# EAGLE board untitled (EAGLE 9.1.3), part 1 of 2
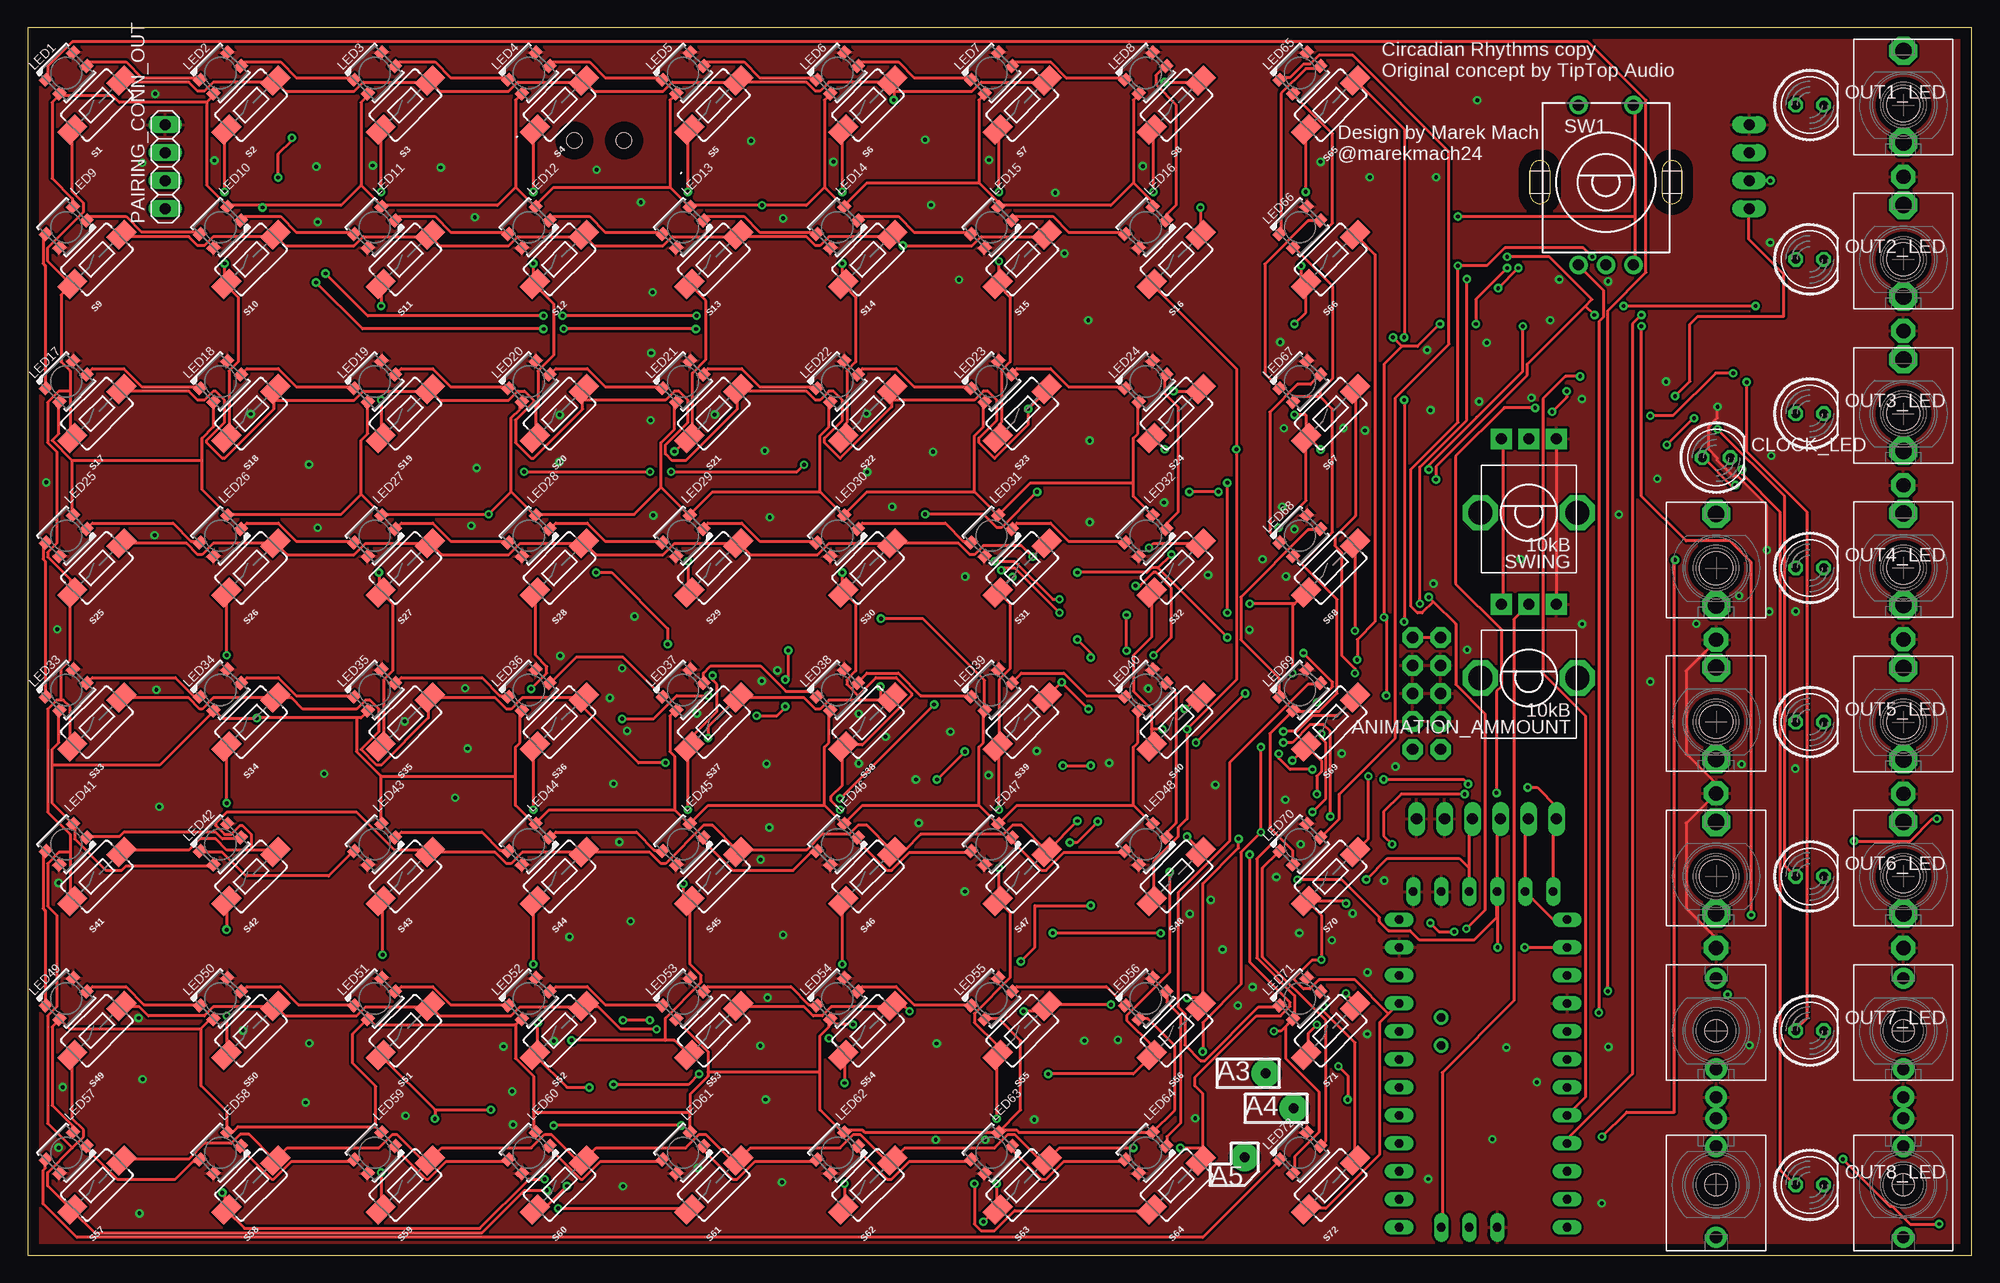
[diagram p6: board, top side]
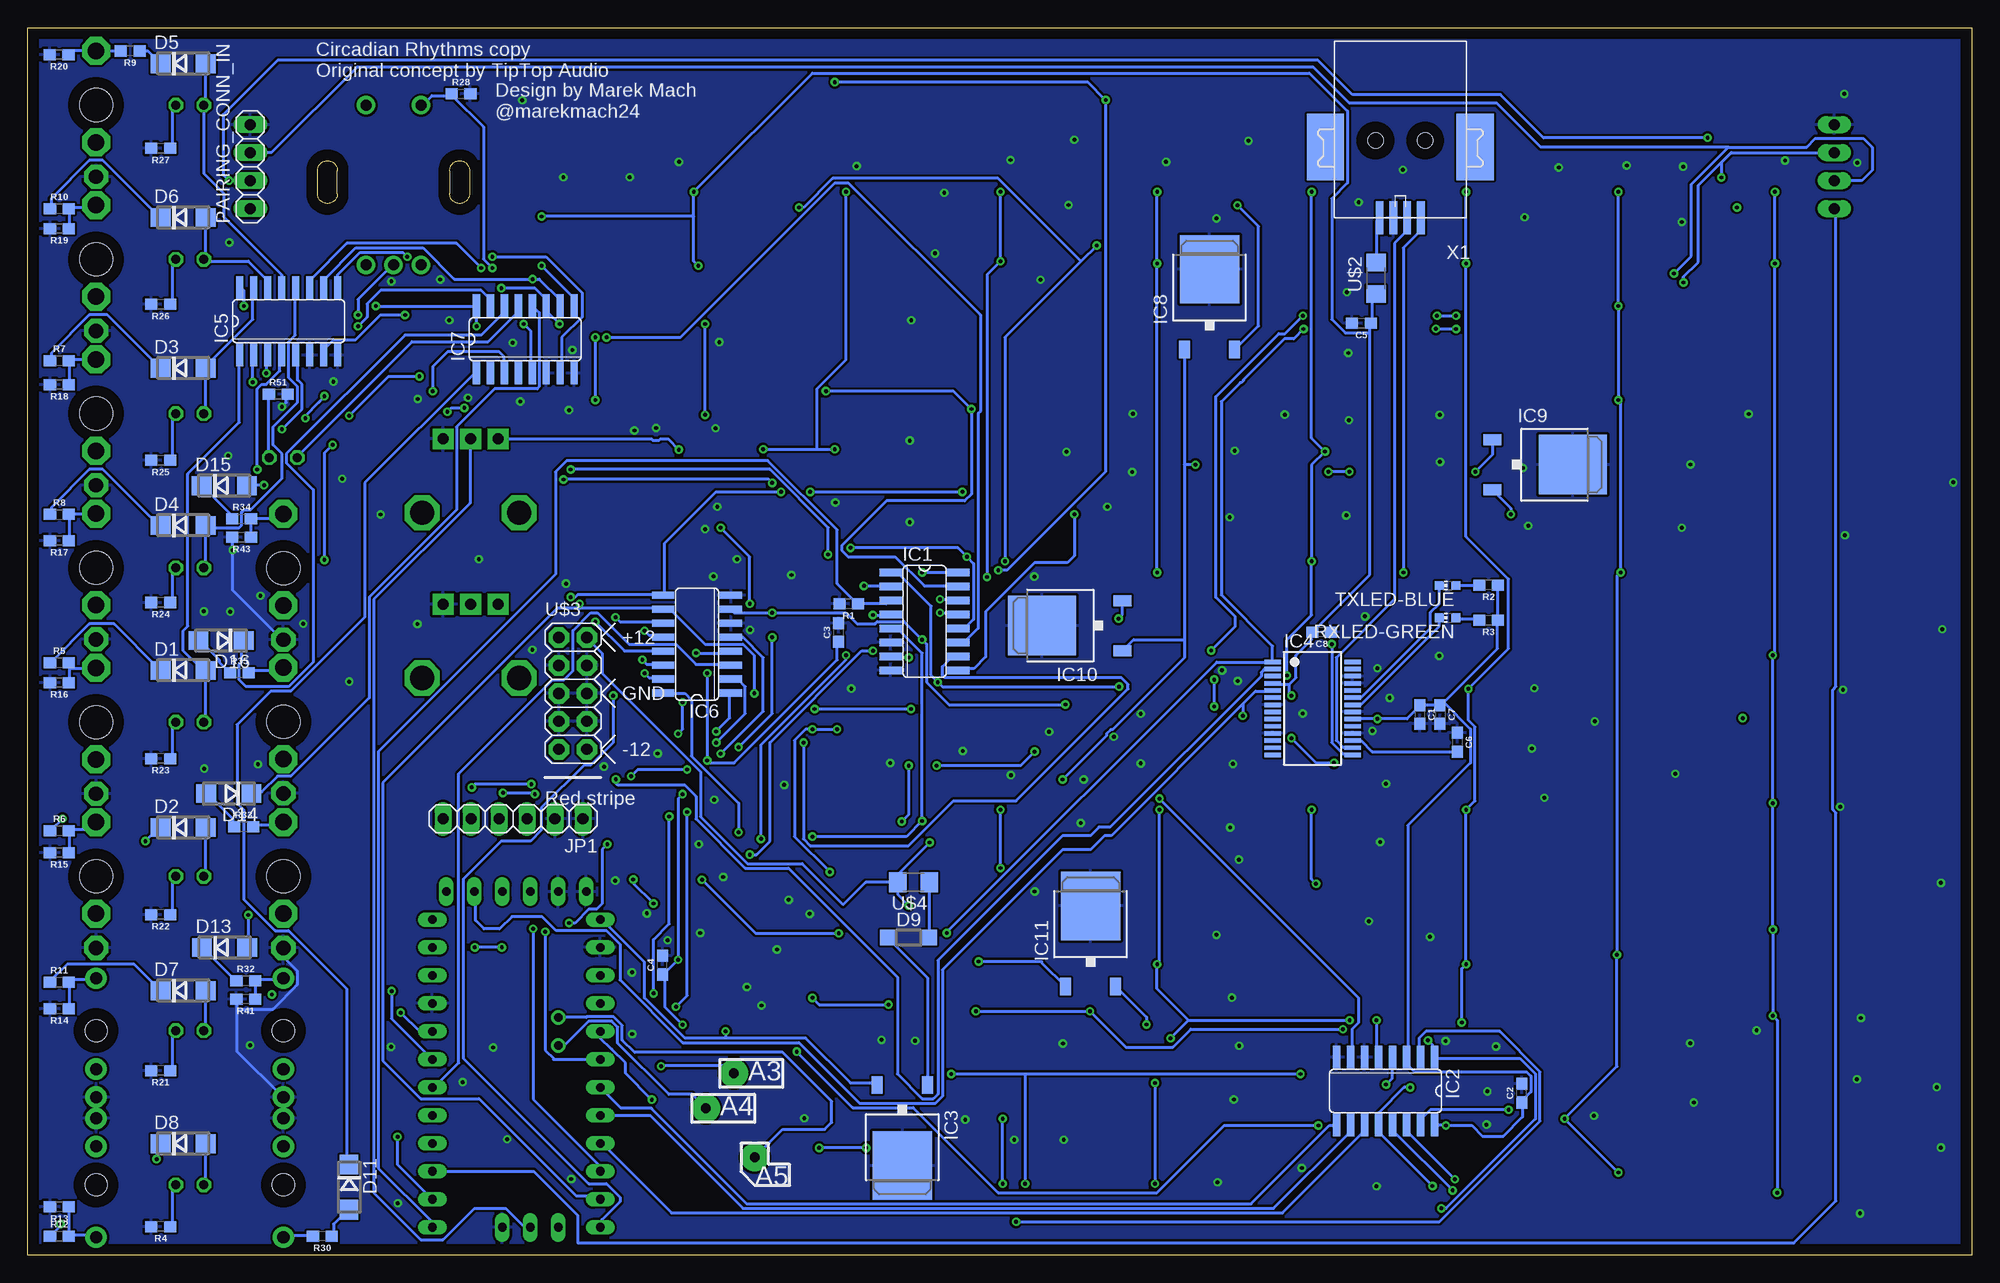
[diagram p7: board, bottom side, seen from below]

Size 176.51 x 111.43 mm. Coordinates in mm from the lower left corner, seen from the top.
Outline: 0,0 176.51,0 176.51,111.43 0,111.43 0,0
Copper layers (1*16): Top 0.035mm / dielectric 1.5mm / Bottom 0.035mm
Design rules "default": minimum track width 6mil, minimum drill 0.35mm, track to track 6mil, track to pad 6mil, pad to pad 6mil, via to via 6mil, smd to smd 6mil, copper to edge 40mil, drill to drill 6mil, minimum pad ring 10mil, minimum via ring 8mil, stop-mask expansion 4mil, vias tented up to drill 0mil, thermal gap 10mil
Net classes: 0 default: width 0.254 mm; 1 5V: width 0.305 mm

## Footprints (pad centres in the part's own frame; a part is rotated, then mirrored left to right if it is on the bottom)
ALPS_POT_VERTICAL = drill 1 pad 1.88 square: P$1 -2.5,6.7; P$2 0,6.7; P$3 2.5,6.7 | drill 2.2 pad 3.175 octagon: P$4 -4.4,0; P$5 4.4,0
WQP_PJ_301M8 = drill 1.1 pad 1.93: P1 0,-6.032; P2 0,-3.493; P3 0,4.763 | hole 2: 0,0
0603 = smd 1.1 x 1: 1 -0.85,0; 2 0.85,0
WQP_PJ_301M1 = drill 1.3 pad 2.184 octagon: P1 0,-6.5 | drill 1.5 pad 2.54 octagon: P2 0,-3.38; P3 0,4.92 | hole 3: 0,0
LED5MM = drill 0.813 octagon: A -1.27,0; K 1.27,0
DO214AC = smd 1.8 x 1.7: A 2.05,0; C -2.05,0
SOD123 = smd 1.4 x 1.4: A 1.9,0; C -1.9,0
SO16 = smd 0.66 x 2.032: 1 -4.445,-3.073; 2 -3.175,-3.073; 3 -1.905,-3.073; 4 -0.635,-3.073; 5 0.635,-3.073; 6 1.905,-3.073; 7 3.175,-3.073; 8 4.445,-3.073; 9 4.445,3.073; 10 3.175,3.073; 11 1.905,3.073; 12 0.635,3.073; 13 -0.635,3.073; 14 -1.905,3.073; 15 -3.175,3.073; 16 -4.445,3.073
TO252 = smd 1 x 1.6: 1 -2.28,-4.8; 2 2.28,-4.8 | smd 5.4 x 6.2: 3 0,2.5
SSOP28 = smd 0.4 x 1.5: 1 -4.225,-3.625; 2 -3.575,-3.625; 3 -2.925,-3.625; 4 -2.275,-3.625; 5 -1.625,-3.625; 6 -0.975,-3.625; 7 -0.325,-3.625; 8 0.325,-3.625; 9 0.975,-3.625; 10 1.625,-3.625; 11 2.275,-3.625; 12 2.925,-3.625; 13 3.575,-3.625; 14 4.225,-3.625; 15 4.225,3.625; 16 3.575,3.625; 17 2.925,3.625; 18 2.275,3.625; 19 1.625,3.625; 20 0.975,3.625; 21 0.325,3.625; 22 -0.325,3.625; 23 -0.975,3.625; 24 -1.625,3.625; 25 -2.275,3.625; 26 -2.925,3.625; 27 -3.575,3.625; 28 -4.225,3.625
1X06 = drill 1.016 long: 1 -6.35,0; 2 -3.81,0; 3 -1.27,0; 4 1.27,0; 5 3.81,0; 6 6.35,0
LED3535 = smd 1 x 0.85: 1 -1.75,0.875; 2 -1.75,-0.875; 3 1.75,-0.875; 4 1.75,0.875
1X04 = drill 1.016 long: 1 -3.81,0; 2 -1.27,0; 3 1.27,0; 4 3.81,0
CHIP-LED0603 = smd 0.8 x 0.8: A 0,-0.75; C 0,0.75
TACTILE_SWITCH_SMD_6.0X3.5MM = smd 2.3 x 1.6: 1 -3.15,0; 2 3.15,0
CI-11 = drill 1 pad 1.676: A -2.5,-7.5; B 0,-7.5; C 2.5,-7.5; D -2.5,7; E 2.5,7
ABK-PRO-MINI = drill 0.8 long: A0 10.16,-11.43; A1 10.16,-8.89; A2 10.16,-6.35; A3 10.16,-3.81; A6 3.81,-21.59; A7 6.35,-21.59; D2 -5.08,-3.81; D3 -5.08,-6.35; D4 -5.08,-8.89; D5 -5.08,-11.43; D6 -5.08,-13.97; D7 -5.08,-16.51; D8 -5.08,-19.05; D9 -5.08,-21.59; D10 10.16,-21.59; D11 10.16,-19.05; D12 10.16,-16.51; D13 10.16,-13.97; DTR -3.81,8.89; GND 10.16,3.81; GND1 -5.08,-1.27; GND2 8.89,8.89; GND3 6.35,8.89; GND4 1.27,-21.59; RAW 10.16,6.35; RST 10.16,1.27; RST1 -5.08,1.27; RX1 -5.08,3.81; RX1-1 1.27,8.89; TX0 -5.08,6.35; TX0-1 -1.27,8.89; VCC 10.16,-1.27; VCC1 3.81,8.89 | drill 0.8: A4 6.35,-5.08; A5 6.35,-2.54
1206 = smd 1.6 x 1.803: 1 -1.422,0; 2 1.422,0
POWER_10 = drill 1.016 pad 1.88 octagon: 1 -5.08,-1.27; 2 -5.08,1.27; 3 -2.54,-1.27; 4 -2.54,1.27; 5 0,-1.27; 6 0,1.27; 7 2.54,-1.27; 8 2.54,1.27; 9 5.08,-1.27; 10 5.08,1.27
USB-B-SMT = smd 6.04 x 3.4: 5 0.58,6.8; 6 0.58,-6.8 | smd 3 x 0.7: D+ 7,1.875; D- 7,0.625; GND 7,-0.625; VUSB 7,-1.875 | hole 1.4: 0,2.25; 0,-2.25

## Placement (x,y rotation side)
ANIMATION_AMMOUNT  10kB  [ALPS_POT_VERTICAL]  136.29,52.4 0 top
ANIMATION_IN  PJ301_THONKICONN8  [WQP_PJ_301M8]  153.28,6.4 180 top
C1  0.1uF  [0603]  50.13,49.09 270 bottom
C2  0.1uF  [0603]  40.87,14.72 90 bottom
C3  0.1uF  [0603]  102.87,56.53 90 bottom
C4  0.1uF  [0603]  118.87,26.34 90 bottom
C5  0.1uF  [0603]  55.42,84.59 180 bottom
C6  0.1uF  [0603]  46.73,46.57 270 bottom
C7  10uF  [0603]  48.29,49.09 270 bottom
C8  0.1uF  [0603]  59.03,56.56 180 bottom
CLOCK_IN  PJ301_THONKICONN1  [WQP_PJ_301M1]  153.28,48.43 0 top
CLOCK_LED  [LED5MM]  153.28,72.4 0 top
CLOCK_OUT  PJ301_THONKICONN1  [WQP_PJ_301M1]  153.28,62.37 0 top
D1  [DO214AC]  162.38,53.09 0 bottom
D2  [DO214AC]  162.38,38.82 0 bottom
D3  [DO214AC]  162.38,80.51 0 bottom
D4  [DO214AC]  162.38,66.24 0 bottom
D5  [DO214AC]  162.38,108.15 0 bottom
D6  [DO214AC]  162.38,94.18 0 bottom
D7  [DO214AC]  162.38,24.02 0 bottom
D8  [DO214AC]  162.38,10.13 0 bottom
D9  1N5819HW  [SOD123]  96.55,28.83 0 bottom
D11  [DO214AC]  147.33,6.19 270 bottom
D13  [DO214AC]  158.62,27.93 0 bottom
D14  [DO214AC]  158.23,41.92 180 bottom
D15  [DO214AC]  158.65,69.84 0 bottom
D16  [DO214AC]  158.94,55.81 180 bottom
IC1  4051D  [SO16]  95.08,57.53 270 bottom
IC2  4051D  [SO16]  53.23,14.92 180 bottom
IC3  7805DT  [TO252]  97.1,10.65 180 bottom
IC4  FT232RL  [SSOP28]  59.86,49.64 270 bottom
IC5  4051D  [SO16]  152.81,84.78 0 bottom
IC6  4051D  [SO16]  115.74,55.47 90 bottom
IC7  4051D  [SO16]  131.33,83.14 0 bottom
IC8  7805DT  [TO252]  69.22,87 0 bottom
IC9  7805DT  [TO252]  38.73,71.75 270 bottom
IC10  7805DT  [TO252]  81.92,57.15 90 bottom
IC11  7805DT  [TO252]  80.01,29.21 0 bottom
JP1  [1X06]  132.44,39.61 180 bottom
LED1  WS2812B3535  [LED3535]  3.51,107.31 45 top
LED2  WS2812B3535  [LED3535]  17.51,107.31 45 top
LED3  WS2812B3535  [LED3535]  31.51,107.31 45 top
LED4  WS2812B3535  [LED3535]  45.51,107.31 45 top
LED5  WS2812B3535  [LED3535]  59.51,107.31 45 top
LED6  WS2812B3535  [LED3535]  73.51,107.31 45 top
LED7  WS2812B3535  [LED3535]  87.51,107.31 45 top
LED8  WS2812B3535  [LED3535]  101.51,107.31 45 top
LED9  WS2812B3535  [LED3535]  3.51,93.31 225 top
LED10  WS2812B3535  [LED3535]  17.51,93.31 225 top
LED11  WS2812B3535  [LED3535]  31.51,93.31 225 top
LED12  WS2812B3535  [LED3535]  45.51,93.31 225 top
LED13  WS2812B3535  [LED3535]  59.51,93.31 225 top
LED14  WS2812B3535  [LED3535]  73.51,93.31 225 top
LED15  WS2812B3535  [LED3535]  87.51,93.31 225 top
LED16  WS2812B3535  [LED3535]  101.51,93.31 225 top
LED17  WS2812B3535  [LED3535]  3.51,79.31 45 top
LED18  WS2812B3535  [LED3535]  17.51,79.31 45 top
LED19  WS2812B3535  [LED3535]  31.51,79.31 45 top
LED20  WS2812B3535  [LED3535]  45.51,79.31 45 top
LED21  WS2812B3535  [LED3535]  59.51,79.31 45 top
LED22  WS2812B3535  [LED3535]  73.51,79.31 45 top
LED23  WS2812B3535  [LED3535]  87.51,79.31 45 top
LED24  WS2812B3535  [LED3535]  101.51,79.31 45 top
LED25  WS2812B3535  [LED3535]  3.51,65.31 225 top
LED26  WS2812B3535  [LED3535]  17.51,65.31 225 top
LED27  WS2812B3535  [LED3535]  31.51,65.31 225 top
LED28  WS2812B3535  [LED3535]  45.51,65.31 225 top
LED29  WS2812B3535  [LED3535]  59.51,65.31 225 top
LED30  WS2812B3535  [LED3535]  73.51,65.31 225 top
LED31  WS2812B3535  [LED3535]  87.51,65.31 225 top
LED32  WS2812B3535  [LED3535]  101.51,65.31 225 top
LED33  WS2812B3535  [LED3535]  3.51,51.31 45 top
LED34  WS2812B3535  [LED3535]  17.51,51.31 45 top
LED35  WS2812B3535  [LED3535]  31.51,51.31 45 top
LED36  WS2812B3535  [LED3535]  45.51,51.31 45 top
LED37  WS2812B3535  [LED3535]  59.51,51.31 45 top
LED38  WS2812B3535  [LED3535]  73.51,51.31 45 top
LED39  WS2812B3535  [LED3535]  87.51,51.31 45 top
LED40  WS2812B3535  [LED3535]  101.51,51.31 45 top
LED41  WS2812B3535  [LED3535]  3.51,37.31 225 top
LED42  WS2812B3535  [LED3535]  17.51,37.31 45 top
LED43  WS2812B3535  [LED3535]  31.51,37.31 225 top
LED44  WS2812B3535  [LED3535]  45.51,37.31 225 top
LED45  WS2812B3535  [LED3535]  59.51,37.31 225 top
LED46  WS2812B3535  [LED3535]  73.51,37.31 225 top
LED47  WS2812B3535  [LED3535]  87.51,37.31 225 top
LED48  WS2812B3535  [LED3535]  101.51,37.31 225 top
LED49  WS2812B3535  [LED3535]  3.51,23.31 45 top
LED50  WS2812B3535  [LED3535]  17.51,23.31 45 top
LED51  WS2812B3535  [LED3535]  31.51,23.31 45 top
LED52  WS2812B3535  [LED3535]  45.51,23.31 45 top
LED53  WS2812B3535  [LED3535]  59.51,23.31 45 top
LED54  WS2812B3535  [LED3535]  73.51,23.31 45 top
LED55  WS2812B3535  [LED3535]  87.51,23.31 45 top
LED56  WS2812B3535  [LED3535]  101.51,23.31 45 top
LED57  WS2812B3535  [LED3535]  3.51,9.31 225 top
LED58  WS2812B3535  [LED3535]  17.51,9.31 225 top
LED59  WS2812B3535  [LED3535]  31.51,9.31 225 top
LED60  WS2812B3535  [LED3535]  45.51,9.31 225 top
LED61  WS2812B3535  [LED3535]  59.51,9.31 225 top
LED62  WS2812B3535  [LED3535]  73.51,9.31 225 top
LED63  WS2812B3535  [LED3535]  87.51,9.31 225 top
LED64  WS2812B3535  [LED3535]  101.51,9.31 225 top
LED65  WS2812B3535  [LED3535]  115.51,107.31 45 top
LED66  WS2812B3535  [LED3535]  115.51,93.31 45 top
LED67  WS2812B3535  [LED3535]  115.51,79.31 45 top
LED68  WS2812B3535  [LED3535]  115.51,65.31 45 top
LED69  WS2812B3535  [LED3535]  115.51,51.31 45 top
LED70  WS2812B3535  [LED3535]  115.51,37.31 45 top
LED71  WS2812B3535  [LED3535]  115.51,23.31 45 top
LED72  WS2812B3535  [LED3535]  115.51,9.31 45 top
OUT1  PJ301_THONKICONN1  [WQP_PJ_301M1]  170.29,104.4 0 top
OUT1_LED  [LED5MM]  161.79,104.4 0 top
OUT2  PJ301_THONKICONN1  [WQP_PJ_301M1]  170.29,90.4 0 top
OUT2_LED  [LED5MM]  161.79,90.4 0 top
OUT3  PJ301_THONKICONN1  [WQP_PJ_301M1]  170.29,76.4 0 top
OUT3_LED  [LED5MM]  161.79,76.4 0 top
OUT4  PJ301_THONKICONN1  [WQP_PJ_301M1]  170.29,62.4 0 top
OUT4_LED  [LED5MM]  161.79,62.4 0 top
OUT5  PJ301_THONKICONN1  [WQP_PJ_301M1]  170.29,48.4 0 top
OUT5_LED  [LED5MM]  161.79,48.4 0 top
OUT6  PJ301_THONKICONN1  [WQP_PJ_301M1]  170.29,34.4 0 top
OUT6_LED  [LED5MM]  161.79,34.4 0 top
OUT7  PJ301_THONKICONN8  [WQP_PJ_301M8]  170.29,20.4 0 top
OUT7_LED  [LED5MM]  161.79,20.4 0 top
OUT8  PJ301_THONKICONN8  [WQP_PJ_301M8]  170.29,6.4 180 top
OUT8_LED  [LED5MM]  161.79,6.4 0 top
PAIRING_CONN_IN  [1X04]  156.29,98.81 90 bottom
PAIRING_CONN_OUT  [1X04]  12.5,98.81 90 top
R1  10k  [0603]  101.96,59.13 180 bottom
R2  470  [0603]  43.87,60.83 180 bottom
R3  470  [0603]  43.87,57.64 180 bottom
R4  470  [0603]  164.42,2.61 180 bottom
R5  100  [0603]  173.62,53.79 0 bottom
R6  100  [0603]  173.62,38.55 0 bottom
R7  100  [0603]  173.62,81.21 0 bottom
R8  100  [0603]  173.62,67.24 0 bottom
R9  100  [0603]  167.19,109.3 180 bottom
R10  100  [0603]  173.62,94.99 0 bottom
R11  100  [0603]  173.62,24.8 0 bottom
R12  100  [0603]  173.62,1.75 0 bottom
R13  10k  [0603]  173.62,4.41 180 bottom
R14  10k  [0603]  173.62,22.38 180 bottom
R15  10k  [0603]  173.62,36.54 180 bottom
R16  10k  [0603]  173.62,51.97 180 bottom
R17  10k  [0603]  173.62,64.86 180 bottom
R18  10k  [0603]  173.62,79.02 180 bottom
R19  10k  [0603]  173.62,93.18 180 bottom
R20  10k  [0603]  173.65,108.97 180 bottom
R21  470  [0603]  164.42,16.77 180 bottom
R22  470  [0603]  164.42,30.93 180 bottom
R23  470  [0603]  164.42,45.09 180 bottom
R24  470  [0603]  164.42,59.25 180 bottom
R25  470  [0603]  164.42,72.14 180 bottom
R26  470  [0603]  164.42,86.3 180 bottom
R27  470  [0603]  164.42,100.46 180 bottom
R28  10k  [0603]  137.16,105.41 0 bottom
R30  100  [0603]  149.75,1.74 180 bottom
R32  100  [0603]  156.7,24.93 0 bottom
R33  100  [0603]  156.89,38.9 0 bottom
R34  100  [0603]  157.08,66.84 0 bottom
R35  100  [0603]  157.27,52.87 0 bottom
R41  10k  [0603]  156.7,23.25 180 bottom
R43  10k  [0603]  157.08,65.16 180 bottom
R51  470  [0603]  153.75,78.16 0 bottom
RESET_IN  PJ301_THONKICONN1  [WQP_PJ_301M1]  153.28,34.4 0 top
RESET_OUT  PJ301_THONKICONN8  [WQP_PJ_301M8]  153.28,20.4 0 top
RXLED-GREEN  [CHIP-LED0603]  47.6,57.87 90 bottom
S1  [TACTILE_SWITCH_SMD_6.0X3.5MM]  6.29,104.4 45 top
S2  [TACTILE_SWITCH_SMD_6.0X3.5MM]  20.29,104.4 45 top
S3  [TACTILE_SWITCH_SMD_6.0X3.5MM]  34.29,104.4 45 top
S4  [TACTILE_SWITCH_SMD_6.0X3.5MM]  48.29,104.4 45 top
S5  [TACTILE_SWITCH_SMD_6.0X3.5MM]  62.29,104.4 45 top
S6  [TACTILE_SWITCH_SMD_6.0X3.5MM]  76.29,104.4 45 top
S7  [TACTILE_SWITCH_SMD_6.0X3.5MM]  90.29,104.4 45 top
S8  [TACTILE_SWITCH_SMD_6.0X3.5MM]  104.29,104.4 45 top
S9  [TACTILE_SWITCH_SMD_6.0X3.5MM]  6.29,90.4 45 top
S10  [TACTILE_SWITCH_SMD_6.0X3.5MM]  20.29,90.4 45 top
S11  [TACTILE_SWITCH_SMD_6.0X3.5MM]  34.29,90.4 45 top
S12  [TACTILE_SWITCH_SMD_6.0X3.5MM]  48.29,90.4 45 top
S13  [TACTILE_SWITCH_SMD_6.0X3.5MM]  62.29,90.4 45 top
S14  [TACTILE_SWITCH_SMD_6.0X3.5MM]  76.29,90.4 45 top
S15  [TACTILE_SWITCH_SMD_6.0X3.5MM]  90.29,90.4 45 top
S16  [TACTILE_SWITCH_SMD_6.0X3.5MM]  104.29,90.4 45 top
S17  [TACTILE_SWITCH_SMD_6.0X3.5MM]  6.29,76.4 45 top
S18  [TACTILE_SWITCH_SMD_6.0X3.5MM]  20.29,76.4 45 top
S19  [TACTILE_SWITCH_SMD_6.0X3.5MM]  34.29,76.4 45 top
S20  [TACTILE_SWITCH_SMD_6.0X3.5MM]  48.29,76.4 45 top
S21  [TACTILE_SWITCH_SMD_6.0X3.5MM]  62.29,76.4 45 top
S22  [TACTILE_SWITCH_SMD_6.0X3.5MM]  76.29,76.4 45 top
S23  [TACTILE_SWITCH_SMD_6.0X3.5MM]  90.29,76.4 45 top
S24  [TACTILE_SWITCH_SMD_6.0X3.5MM]  104.29,76.4 45 top
S25  [TACTILE_SWITCH_SMD_6.0X3.5MM]  6.29,62.4 45 top
S26  [TACTILE_SWITCH_SMD_6.0X3.5MM]  20.29,62.4 45 top
S27  [TACTILE_SWITCH_SMD_6.0X3.5MM]  34.29,62.4 45 top
S28  [TACTILE_SWITCH_SMD_6.0X3.5MM]  48.29,62.4 45 top
S29  [TACTILE_SWITCH_SMD_6.0X3.5MM]  62.29,62.4 45 top
S30  [TACTILE_SWITCH_SMD_6.0X3.5MM]  76.29,62.4 45 top
S31  [TACTILE_SWITCH_SMD_6.0X3.5MM]  90.29,62.4 45 top
S32  [TACTILE_SWITCH_SMD_6.0X3.5MM]  104.29,62.4 45 top
S33  [TACTILE_SWITCH_SMD_6.0X3.5MM]  6.29,48.4 45 top
S34  [TACTILE_SWITCH_SMD_6.0X3.5MM]  20.29,48.4 45 top
S35  [TACTILE_SWITCH_SMD_6.0X3.5MM]  34.29,48.4 45 top
S36  [TACTILE_SWITCH_SMD_6.0X3.5MM]  48.29,48.4 45 top
S37  [TACTILE_SWITCH_SMD_6.0X3.5MM]  62.29,48.4 45 top
S38  [TACTILE_SWITCH_SMD_6.0X3.5MM]  76.29,48.4 45 top
S39  [TACTILE_SWITCH_SMD_6.0X3.5MM]  90.29,48.4 45 top
S40  [TACTILE_SWITCH_SMD_6.0X3.5MM]  104.29,48.4 45 top
S41  [TACTILE_SWITCH_SMD_6.0X3.5MM]  6.29,34.4 45 top
S42  [TACTILE_SWITCH_SMD_6.0X3.5MM]  20.29,34.4 45 top
S43  [TACTILE_SWITCH_SMD_6.0X3.5MM]  34.29,34.4 45 top
S44  [TACTILE_SWITCH_SMD_6.0X3.5MM]  48.29,34.4 45 top
S45  [TACTILE_SWITCH_SMD_6.0X3.5MM]  62.29,34.4 45 top
S46  [TACTILE_SWITCH_SMD_6.0X3.5MM]  76.29,34.4 45 top
S47  [TACTILE_SWITCH_SMD_6.0X3.5MM]  90.29,34.4 45 top
S48  [TACTILE_SWITCH_SMD_6.0X3.5MM]  104.29,34.4 45 top
S49  [TACTILE_SWITCH_SMD_6.0X3.5MM]  6.29,20.4 45 top
S50  [TACTILE_SWITCH_SMD_6.0X3.5MM]  20.29,20.4 45 top
S51  [TACTILE_SWITCH_SMD_6.0X3.5MM]  34.29,20.4 45 top
S52  [TACTILE_SWITCH_SMD_6.0X3.5MM]  48.29,20.4 45 top
S53  [TACTILE_SWITCH_SMD_6.0X3.5MM]  62.29,20.4 45 top
S54  [TACTILE_SWITCH_SMD_6.0X3.5MM]  76.29,20.4 45 top
S55  [TACTILE_SWITCH_SMD_6.0X3.5MM]  90.29,20.4 45 top
S56  [TACTILE_SWITCH_SMD_6.0X3.5MM]  104.29,20.4 45 top
S57  [TACTILE_SWITCH_SMD_6.0X3.5MM]  6.29,6.4 45 top
S58  [TACTILE_SWITCH_SMD_6.0X3.5MM]  20.29,6.4 45 top
S59  [TACTILE_SWITCH_SMD_6.0X3.5MM]  34.29,6.4 45 top
S60  [TACTILE_SWITCH_SMD_6.0X3.5MM]  48.29,6.4 45 top
S61  [TACTILE_SWITCH_SMD_6.0X3.5MM]  62.29,6.4 45 top
S62  [TACTILE_SWITCH_SMD_6.0X3.5MM]  76.29,6.4 45 top
S63  [TACTILE_SWITCH_SMD_6.0X3.5MM]  90.29,6.4 45 top
S64  [TACTILE_SWITCH_SMD_6.0X3.5MM]  104.29,6.4 45 top
S65  [TACTILE_SWITCH_SMD_6.0X3.5MM]  118.29,104.4 45 top
S66  [TACTILE_SWITCH_SMD_6.0X3.5MM]  118.29,90.4 45 top
S67  [TACTILE_SWITCH_SMD_6.0X3.5MM]  118.29,76.4 45 top
S68  [TACTILE_SWITCH_SMD_6.0X3.5MM]  118.29,62.4 45 top
S69  [TACTILE_SWITCH_SMD_6.0X3.5MM]  118.29,48.4 45 top
S70  [TACTILE_SWITCH_SMD_6.0X3.5MM]  118.29,34.4 45 top
S71  [TACTILE_SWITCH_SMD_6.0X3.5MM]  118.29,20.4 45 top
S72  [TACTILE_SWITCH_SMD_6.0X3.5MM]  118.29,6.4 45 top
SW1  CI-11  [CI-11]  143.29,97.4 0 top
SWING  10kB  [ALPS_POT_VERTICAL]  136.29,67.4 0 top
TXLED-BLUE  [CHIP-LED0603]  47.6,60.79 90 bottom
U$1  ABK-PRO-MINI  [ABK-PRO-MINI]  134.68,24.13 0 bottom
U$2  PTC-FUSE  [1206]  54.09,88.68 90 bottom
U$3  POWER_SIMPLE10  [POWER_10]  127,51 90 bottom
U$4  PTC-FUSE  [1206]  96.09,33.86 180 bottom
X1  [USB-B-SMT]  51.89,101.18 270 bottom

## Tracks (layer width: path | path; a pad name or v marks a point on that pad's centre or on a via)
5V_FROM_SOURCE1  (via drill 0.35)
  Top 0.254: 117.35,77.93 114.91,77.93 LED67.2 | 115.62,90.83 115.01,91.44 LED66.2 | 115.62,90.83 118.47,87.99 118.47,79.58 117.35,78.46 117.35,77.93 | 115.62,90.83 118.47,93.67 118.47,101.8 115.01,105.26 LED65.2 | LED72.2 115.01,7.52 115.01,8.94 117.25,11.18 117.25,14.83 114.2,17.88 114.2,20.73 114.81,21.34 LED71.2 | 113.59,38 112.78,38.81 112.78,47.35 114.81,49.38 LED69.2 115.01,49.38 117.25,49.38 118.87,51 118.87,59.54 115.62,62.79 | 113.59,38 114.81,36.78 114.81,35.56 LED70.2 | 115.62,62.79 115.01,63.4 LED68.2 | 113.59,38 111.58,35.99 111.58,27 115.01,23.57 115.01,21.54 LED71.2 | 117.35,77.93 118.47,76.81 118.47,65.63 115.62,62.79 | LED71.2 113.77,20.34 v113.14,20.34
  Bottom 0.254: IC3.2 99.57,15.65 101.8,15.65 105.87,19.71 113.16,19.71 | 113.16,19.71 116.84,19.71 120.5,23.37 120.5,26.62 124.36,30.48 U$1.RAW | v113.14,20.34 113.14,19.73 113.16,19.71
5V_LED_SOURCE1  (via drill 0.35)
  Top 0.254: 86.36,97.33 87.99,95.71 87.99,95.3 LED15.2 88.19,95.3 98.35,95.3 100.38,97.33 | 86.36,97.33 86.36,104.85 86.77,105.26 LED7.2 | 100.38,97.33 102.01,95.71 102.01,95.3 LED16.2 | 100.38,97.33 100.38,104.85 100.79,105.26 LED8.2 | 58.32,96.93 59.94,95.3 LED13.2 60.15,95.3 v66.67,95.3 70.71,95.3 72.34,96.93 | 58.32,96.93 58.32,104.85 58.73,105.26 LED5.2 | 72.34,96.93 73.97,95.3 LED14.2 74.17,95.3 76.2,97.33 86.36,97.33 | 72.34,96.93 72.34,104.85 72.75,105.26 LED6.2 | LED9.2 4.06,95.3 4.06,95.91 2.23,97.74 2.23,104.65 2.85,105.26 LED1.2 3.05,105.26 7.72,105.26 8.33,104.65 16.26,104.65 | 16.26,104.65 16.26,97.13 18.09,95.3 LED10.2 18.29,95.3 21.34,95.3 | 16.26,104.65 16.87,105.26 LED2.2 | 30.28,97.13 32.11,95.3 LED11.2 32.31,95.3 42.67,95.3 44.3,96.93 | 30.28,97.13 30.28,104.65 30.89,105.26 LED3.2 | 44.3,96.93 45.92,95.3 LED12.2 46.13,95.3 47.75,96.93 58.32,96.93 | 44.3,96.93 44.3,104.85 44.7,105.26 LED4.2 | 21.34,95.3 28.45,95.3 30.28,97.13 | v21.34,95.1 21.34,95.3
  Bottom 0.254: IC8.2 64.77,84.36 64.77,93.4 v66.67,95.3
5V_LED_SOURCE2  (via drill 0.35)
  Top 0.254: 4.06,72.14 2.23,73.97 2.85,74.57 2.85,77.42 LED17.2 | 4.06,72.14 4.06,67.26 LED25.2 | 15.85,72.14 15.85,69.49 18.09,67.26 18.09,67.21 LED26.2 18.22,67.26 28.45,67.26 30.28,69.09 | 15.85,72.14 15.85,74.17 16.87,75.18 16.87,77.42 16.89,77.44 LED18.2 | 15.85,72.14 4.06,72.14 | 30.28,69.09 30.28,73.97 30.89,74.57 30.89,77.42 LED19.2 | 30.28,69.09 32.11,67.26 LED27.2 32.22,67.17 32.31,67.26 v41.86,67.26 43.89,69.29 | 43.89,69.29 43.89,76 44.7,76.81 44.7,77.42 LED20.2 | 43.89,69.29 45.92,67.26 LED28.2 46.13,67.26 | 57.51,69.7 57.51,73.76 58.73,74.98 58.73,77.42 LED21.2 | 57.51,69.7 59.94,67.26 LED29.2 60.13,67.24 62.18,69.29 71.93,69.29 | 46.13,67.26 55.07,67.26 57.51,69.7 | 71.93,69.29 71.93,74.37 72.75,75.18 72.75,77.42 LED22.2 | 71.93,69.29 73.97,67.26 LED30.2 74.13,67.22 76.2,69.29 85.95,69.29 | 85.95,69.29 85.95,74.37 86.77,75.18 86.77,77.42 LED23.2 | 85.95,69.29 87.99,67.26 LED31.2 88.13,67.2 91.03,70.1 100.38,70.1 | 100.38,70.1 100.38,68.89 102.01,67.26 LED32.2 | 100.38,70.1 100.38,74.17 100.79,74.57 100.79,77.42 LED24.2 | 46.13,67.26
  Bottom 0.254: IC9.2 41.86,67.8 v41.86,67.26
5V_LED_SOURCE3  (via drill 0.35)
  Top 0.254: 2.23,44.5 2.23,41.05 4.06,39.22 LED41.2 4.27,39.01 4.27,37.8 7.11,34.95 8.53,34.95 8.94,35.36 16.79,35.36 | 2.23,44.5 2.23,45.92 2.85,46.53 2.85,49.38 LED33.2 | 16.79,35.36 16.87,35.36 | 2.23,44.5 11.99,44.5 16.89,49.4 LED34.2 16.99,49.46 17.69,48.76 v20.81,48.76 20.82,48.77 29.87,48.77 | 44.3,43.48 44.3,40.84 45.92,39.22 LED44.2 46.13,39.22 47.35,40.44 58.73,40.44 | 44.3,43.48 44.3,46.13 44.7,46.53 44.7,49.38 LED36.2 | 29.87,48.77 30.28,48.77 30.89,49.38 LED35.2 | 32.11,43.48 32.11,39.22 32.13,39.2 LED43.2 | 32.11,43.48 29.87,45.72 29.87,48.77 | 32.11,43.48 44.3,43.48 | 58.73,40.44 59.94,39.22 LED45.2 60.13,39.2 61.77,40.84 72.34,40.84 | 58.73,40.44 58.73,45.31 58.32,45.72 58.32,48.97 58.73,49.38 LED37.2 | 72.34,40.84 72.34,46.13 72.75,46.53 72.75,49.38 LED38.2 | 72.34,40.84 73.97,39.22 LED46.2 75.79,40.84 86.36,40.84 | 86.36,40.84 86.36,46.13 86.77,46.53 86.77,49.38 LED39.2 86.89,52.18 81.28,57.78 v77.47,57.78 | 86.36,40.84 87.99,39.22 LED47.2 89.81,40.84 100.38,40.84 | 100.38,40.84 100.38,46.13 100.79,46.53 100.79,49.38 LED40.2 | 100.38,40.84 102.01,39.22 LED48.2 | LED42.2 16.79,35.36
  Bottom 0.254: v77.47,57.78 77.11,58.14 IC10.2
5V_LED_SOURCE4  (via drill 0.35)
  Top 0.254: LED57.2 4.06,11.18 4.06,11.79 2.23,13.61 2.23,20.73 2.85,21.34 LED49.2 3.79,20.56 15.73,20.56 | 71.93,16.66 71.93,13.21 73.97,11.18 LED62.2 74.17,11.18 74.37,11.38 75.79,11.38 76,11.18 87.99,11.18 LED63.2 | 71.93,16.66 71.93,19.91 72.75,20.73 72.75,21.34 LED54.2 73.39,20.95 v74.93,20.95 | 60.15,13.01 60.15,14.63 61.77,16.26 61.77,16.66 | 60.15,13.01 60.15,11.18 LED61.2 | 61.77,16.66 61.77,18.49 58.89,21.38 LED53.2 | 61.77,16.66 71.93,16.66 | 45.92,13.01 45.92,16.26 44.3,17.88 44.3,20.93 | 44.3,20.93 31.5,20.93 30.97,21.46 LED51.2 29.52,20.09 29.52,17.43 31.61,15.34 31.61,11.69 | 45.92,13.01 60.15,13.01 | LED56.2 101.69,21.46 104.14,19.01 104.14,13.18 LED64.2 89.99,11.17 89.78,11.38 88.34,11.38 LED63.2 | LED63.2 90.16,13.2 90.16,19.48 88.18,21.46 LED55.2 | 15.73,20.56 16.64,21.46 LED50.2 | 15.73,20.56 15.76,20.54 15.76,15.38 18.13,13.01 LED58.2 18.6,11.17 19.12,11.69 31.61,11.69 | 31.61,11.69 LED59.2 | LED60.2 46.12,11.18 45.92,11.18 45.92,13.01 | LED52.2 44.83,21.46 44.3,20.93
  Bottom 0.254: IC11.2 74.93,21.61 v74.93,20.95
+5V  (via drill 0.35)
  Top 0.254: v61.77,50.8 58.93,50.8 56.82,48.69 v53.98,48.69 | v117.04,20.93 116.23,20.12 116.23,18.29 S71.1 | 123.55,21.95 124.36,22.76 U$1.VCC 124.56,22.96 | 123.55,21.95 122.73,21.13 122.73,9.14 117.86,4.27 116.23,4.27 S72.1 | 123.55,21.95 120.5,24.99 117.25,24.99 116.43,24.18 115.82,24.18 115.01,24.99 115.01,25.2 116.64,26.82 v117.45,26.82 117.45,30.89 116.23,32.11 S70.1 119.46,32.17 v119.69,31.93 | v114.81,44.91 116.03,46.13 S69.1 116.23,46.13 117.45,44.91 117.45,43.89 117.04,43.48 v117.04,41.86 | 145.9,94.28 145.9,104.24 SW1.E | 145.9,94.28 145.9,90.02 SW1.C | 114.81,59.13 115.01,59.13 116.03,60.15 S68.1 | 114.81,59.13 v110.95,59.13 | v113.59,66.04 116.05,68.5 S67.1 | v115.01,84.53 116.03,85.55 116.03,87.99 S66.1 116.03,88.19 115.62,88.59 v115.62,89.81 | v116.03,96.52 116.03,102.01 S65.1 | v129.84,94.28 145.9,94.28 | 114.81,59.13 v114.81,52.83 | v115.01,76.28 116.04,76.28 S67.1 | ANIMATION_AMMOUNT.P$1 133.91,59.13 133.91,73.97 SWING.P$1 | v117.39,73.13 116.36,74.16 S67.1 | U$1.VCC1 130.87,35.13 | 130.87,35.13 130.87,39.31 JP1.3 | v121.53,34.11 123.45,36.03 129.97,36.03 130.87,35.13
  Bottom 0.254: U$2.1 54.25,87.17 54.46,86.97 54.46,84.73 C5.1 54.66,84.53 54.66,83.72 | 61.98,51.82 61.37,52.43 61.37,54.46 59.94,55.88 59.94,56.49 C8.2 59.74,56.69 54.66,61.77 54.66,83.72 | 61.98,51.82 63.4,51.82 IC4.4 | C2.1 40.84,14.02 40.03,14.83 40.03,16.26 40.44,16.66 50.6,16.66 51.21,17.27 51.21,17.88 IC2.3 51.21,18.09 51.21,39.01 45.52,44.7 45.52,47.75 47.95,50.19 | R2.1 43.08,60.76 43.08,57.71 R3.1 43.08,57.51 43.08,55.07 47.95,50.19 | C7.1 48.36,49.99 49.99,49.99 C1.1 50.19,49.78 51.28,48.69 v53.98,48.69 56.2,48.69 IC4.20 | 47.95,50.19 48.16,49.99 C7.1 | 47.95,50.19 C7.1 | 61.98,51.82 61.98,51 v61.77,50.8 | v117.04,20.93 118.67,22.55 118.67,25.4 C4.1 118.67,25.6 v117.45,26.82 117.45,41.45 v117.04,41.86 | C3.1 103.02,55.68 103.02,54.05 112.37,44.7 114.61,44.7 v114.81,44.91 v114.81,52.83 | v113.59,66.04 110.95,63.4 v110.95,59.13 | v115.01,76.28 v115.01,84.53 | 116.03,94.28 116.03,90.22 v115.62,89.81 | 116.03,94.28 v116.03,96.52 105.26,107.29 60.15,107.29 56.69,103.83 56.69,97.33 58.12,95.91 58.12,84.94 56.9,83.72 54.66,83.72 | 116.03,94.28 v129.84,94.28 | v117.39,73.13 118.36,74.1 119.06,74.1 119.18,73.97 119.73,73.97 119.86,74.1 SWING.P$1 | v119.69,31.93 121.53,33.77 v121.53,34.11
A3  (via drill 0.35, 0.9 pad 2.54)
  Top 0.254: v119,17.16 119.84,16.32 v119.84,14.13 | v119,17.16
  Bottom 0.254: v112.39,16.51 113.1,17.22 119,17.22 v119,17.16 | v119,17.16 | U$1.A3 124.52,19.72 123.51,18.71 123.48,18.71 122.24,17.47 122.24,16.53 v119.84,14.13
A4  (via drill 0.9 pad 2.54)
  Bottom 0.254: v114.94,13.34 116.2,14.61 118.29,14.61 122.93,19.25 122.93,20.71 123.48,21.25 125.56,21.25 127.76,19.05 U$1.A4
A5  (via drill 0.9 pad 2.54)
  Bottom 0.254: v110.49,8.89 107.95,11.43 104.14,11.43 103.5,12.06 103.5,13.97 107.95,18.41 121.4,18.41 122.53,19.55 122.53,20.88 123.31,21.66 125.73,21.66 125.8,21.59 U$1.A5
ANIMATION_AMMOUNT
  Top 0.254: U$1.A7 128.42,2.64 128.42,16.59 134.93,23.09 134.93,57.71 136.14,58.93 ANIMATION_AMMOUNT.P$2
COL0  (via drill 0.35)
  Top 0.254: v47.14,5.89 45.11,5.89 41.25,2.03 6.1,2.03 4.06,4.06 S57.1 3.86,4.27 1.83,6.3 1.83,7.52 4.06,9.75 | 4.06,9.75 5.08,10.77 5.08,11.38 4.06,12.39 4.06,18.09 S49.1 | 3.86,36.58 3.86,38.2 1.83,40.23 1.83,49.58 2.64,50.39 3.05,50.39 | 3.86,36.58 3.86,32.31 S41.1 | 3.05,50.39 3.25,50.39 3.86,49.78 3.86,46.33 S33.1 | 3.05,50.39 3.05,53.24 3.86,54.05 3.86,60.15 S25.1 3.86,60.35 3.86,61.37 1.83,63.4 1.83,63.8 2.64,64.62 2.64,72.95 1.83,73.76 1.83,77.42 2.85,78.44 3.86,78.44 | 3.86,78.44 3.86,80.26 3.05,81.08 3.05,87.17 3.86,87.99 S9.1 3.86,88.19 1.83,90.22 1.83,91.44 5.08,94.69 5.08,95.5 4.06,96.52 4.06,102.01 S1.1 | 3.86,78.44 3.86,74.37 S17.1 | 4.06,9.75 1.83,11.99 1.83,21.74 2.64,22.55 2.64,30.89 1.83,31.7 1.83,35.56 2.85,36.58 3.86,36.58
  Bottom 0.254: v47.14,5.89 52.43,11.18 52.43,11.79 IC2.13
COL1  (via drill 0.35)
  Top 0.254: v46.94,6.91 45.52,6.91 41.05,2.44 19.71,2.44 18.09,4.06 S58.1 17.88,4.27 17.88,5.49 v17.68,5.69 | S18.1 18.09,74.37 18.09,75.18 18.29,75.39 18.29,80.26 19.1,81.08 19.1,86.97 18.09,87.99 S10.1 17.88,88.19 v17.88,90.02 | v17.88,96.52 17.88,102.01 S2.1 | v18.09,21.74 18.09,18.29 S50.1 | v18.06,29.56 18.06,32.16 S42.1 | v18.09,41.05 18.09,46.13 S34.1 | v18.09,54.46 18.09,60.15 S26.1
  Bottom 0.254: v46.94,6.91 51.21,11.18 51.21,11.79 IC2.14 | v17.88,96.52 v17.88,90.02 17.88,54.66 v18.09,54.46 v18.09,41.05 18.06,41.02 v18.06,29.56 18.06,21.76 v18.09,21.74 17.68,21.34 v17.68,5.69
COL2  (via drill 0.35)
  Top 0.254: 36.98,13.21 v42.06,13.21 | 36.98,13.21 32.11,18.09 S51.1 | v32.11,7.52 32.11,4.27 S59.1 | 36.98,13.21 v36.98,12.39 | v32.22,27.28 32.22,31.95 S43.1 | S35.1 32.11,46.33 32.11,47.14 32.31,47.35 32.31,52.22 33.12,53.03 33.12,59.13 32.11,60.15 S27.1 31.9,60.35 v31.9,61.98 | v32.11,77.62 32.11,74.37 S19.1 | v32.11,86.16 32.11,87.99 S11.1 | v32.11,96.52 32.11,102.01 S3.1
  Bottom 0.254: v42.06,13.21 49.17,13.21 49.99,12.39 49.99,11.99 IC2.15 | v32.11,7.52 v36.98,12.39 32.22,17.15 v32.22,27.28 32.22,61.66 v31.9,61.98 31.9,77.42 v32.11,77.62 v32.11,86.16 v32.11,96.52
COL3  (via drill 0.35)
  Top 0.254: S20.1 46.13,74.37 46.13,77.01 46.33,77.22 46.33,80.26 47.75,81.69 47.75,86.36 46.13,87.99 S12.1 45.92,88.19 v45.92,90.02 | v45.92,96.52 45.92,102.01 S4.1 | v51,15.24 48.97,15.24 46.13,18.09 S52.1 46.32,18.43 v46.32,21.13 | v48.97,6.3 46.94,4.27 46.13,4.27 S60.1 | v45.92,26.42 45.92,32.11 S44.1 | v45.92,40.44 45.92,46.13 S36.1 | v45.72,51.41 47.14,52.83 47.14,53.44 46.13,54.46 46.13,60.15 S28.1
  Bottom 0.254: v45.92,96.52 v45.92,90.02 45.92,65.23 42.06,61.37 42.06,55.07 v45.72,51.41 45.72,48.56 45.11,47.95 45.11,41.25 v45.92,40.44 v45.92,26.42 46.32,26.02 v46.32,21.13 | v48.97,6.3 53.85,11.18 53.85,11.79 IC2.12 53.85,11.99 53.85,12.95 51.56,15.24 v51,15.24
COL4  (via drill 0.35)
  Top 0.254: v59.94,62.99 59.94,60.35 S29.1 | v58.73,72.95 59.94,74.17 S21.1 60.15,74.37 60.35,74.57 60.35,80.06 61.59,81.31 61.59,86.63 S13.1 | v59.94,96.52 59.94,102.01 S5.1 | 57.91,19.51 58.73,19.51 59.94,18.29 S53.1 | 57.91,19.51 v49.38,19.51 | v48.16,4.27 59.94,4.27 S61.1 | 57.91,19.51 57.91,21.54 61.16,24.79 61.16,25.4 60.15,26.42 60.15,32.11 S45.1 59.94,32.31 59.54,32.72 v59.54,33.73 | v59.94,40.44 59.94,46.13 S37.1 60.15,46.33 60.15,46.94 62.59,49.38 62.59,51.82 62.18,52.22 v62.18,52.63
  Bottom 0.254: v59.94,96.52 59.94,74.17 v58.73,72.95 59.94,71.73 v59.94,62.99 59.94,58.12 62.18,55.88 v62.18,52.63 | v49.38,19.51 48.97,19.1 48.97,18.09 IC2.1 48.77,17.88 41.05,17.88 39.62,16.46 39.62,12.39 47.75,4.27 v48.16,4.27 | v59.94,40.44 59.94,34.14 v59.54,33.73
COL5  (via drill 0.35)
  Top 0.254: S22.1 74.17,74.37 74.17,75.39 74.37,75.59 74.37,80.26 75.18,81.08 75.18,86.97 74.17,87.99 S14.1 73.97,88.19 v73.97,90.02 | v73.97,96.52 73.97,102.01 S6.1 | v56.49,21.34 v54.05,21.34 | v72.75,19.71 74.17,18.29 S54.1 74.17,18.09 v74.17,15.65 | v74.17,6.5 74.17,4.27 S62.1 | v73.97,26.42 73.97,32.11 S46.1 | v73.76,40.44 72.95,41.25 72.95,41.66 73.97,42.67 73.97,46.13 S38.1 74.17,46.33 75.79,46.33 80.26,50.8 80.26,51 78.84,52.43 77.01,52.43 75.39,50.8 74.37,51.82 74.37,52.22 75.18,53.03 75.18,59.13 74.17,60.15 S30.1 73.97,60.35 v73.97,61.98
  Bottom 0.254: v73.97,96.52 v73.97,90.02 v73.97,61.98 | v54.05,21.34 54.05,18.09 IC2.5 | 71.12,21.34 v56.49,21.34 | v72.75,19.71 71.12,21.34 | v74.17,15.65 v74.17,6.5 | 71.12,21.34 73.97,24.18 v73.97,26.42 73.76,26.62 v73.76,40.44
COL6  (via drill 0.35)
  Top 0.254: S23.1 88.19,74.37 88.19,75.39 88.39,75.59 88.39,80.26 89.2,81.08 89.2,86.97 88.19,87.99 S15.1 88.19,88.19 v88.19,90.22 | v88.19,96.52 88.19,102.01 S7.1 | v89.41,61.57 88.19,60.35 S31.1 88.19,60.15 89.2,59.13 89.2,53.24 88.19,52.22 88.19,46.33 S39.1 88.19,46.13 v88.19,40.44 | 87.99,4.27 v86.77,3.05 | 87.99,4.27 S63.1 87.99,4.27 | v87.99,12.39 87.99,18.09 S55.1 87.99,18.29 87.99,19.1 85.95,21.13 85.95,21.95 89.2,25.2 89.2,31.09 88.19,32.11 S47.1 88.19,32.31 v88.19,35.15 | 87.99,4.27 v87.99,6.5
  Bottom 0.254: v88.19,96.52 v88.19,90.22 89.41,89 v89.41,61.57 | v86.77,3.05 48.36,3.05 39.22,12.19 39.22,16.66 42.88,20.32 49.58,20.32 50.19,19.71 50.19,18.09 IC2.2 | v87.99,6.5 v87.99,12.39 | v88.19,35.15 v88.19,40.44
COL7  (via drill 0.35)
  Top 0.254: v53.19,15.51 60.01,15.51 v60.96,16.46 | v92.66,16.46 100.38,16.46 102.01,18.09 S56.1 102.01,18.29 102.01,19.1 99.77,21.34 99.77,21.74 103.68,25.65 103.68,30.43 v103.68,34.8 | v85.95,6.5 85.95,2.85 86.56,2.23 87.78,2.23 89.61,4.06 102.01,4.06 S64.1 | 102.01,47.75 102.01,49.58 100.38,51.21 100.38,54.46 102.01,56.08 102.01,60.15 S32.1 | 102.01,47.75 102.01,46.33 S40.1 | S48.1 102.21,32.31 102.21,35.76 104.44,38 104.44,38.81 105.26,39.62 v105.26,47.75 109.73,52.22 v109.73,73.15 109.73,80.47 102.21,87.99 S16.1 | v103.23,73.15 102.21,74.17 S24.1 | v102.21,96.52 102.21,102.01 S8.1 | v103.02,47.75 102.01,47.75
  Bottom 0.254: v53.19,15.51 52.63,16.06 52.63,17.88 IC2.4 | v92.66,16.46 85.95,16.46 | 85.95,16.46 v60.96,16.46 | 85.95,16.46 v85.95,6.5 | v109.73,73.15 104.85,73.15 | 104.85,73.15 v103.23,73.15 | v102.21,96.52 102.21,81.28 104.85,78.64 104.85,73.15 | v103.02,47.75 v105.26,47.75 105.87,47.75 106.88,46.74 106.88,38 v103.68,34.8
COL_A
  Bottom 0.254: IC2.11 55.27,11.79 55.27,11.18 62.59,3.86 118.06,3.86 124.36,10.16 U$1.D13
COL_B
  Bottom 0.254: IC2.10 56.49,11.79 56.49,11.18 63.4,4.27 111.56,4.27 119.99,12.7 U$1.A0
COL_C
  Bottom 0.254: IC2.9 57.71,11.79 58.32,11.79 65.43,4.67 111.24,4.67 119.87,13.31 119.87,13.35 122.63,13.35 U$1.A1
CTRLBUTTON_OUT
  Bottom 0.254: IC6.3 112.78,53.65 115.82,53.65 117.65,55.47 121.92,55.47 124.77,58.32 125.37,58.32 127,56.69 127,53.03 127.81,52.22 128.83,52.22 137.36,43.69 137.36,17.48 139.6,15.24 U$1.D4
DTR  (via drill 0.35)
  Top 0.254: U$1.DTR 138.49,39.31 JP1.6 | JP1.6 | v123.11,43.2 130.35,43.2 v130.78,42.77 | JP1.6 138.79,40.72 137.04,42.48 v136.19,42.48
  Bottom 0.254: IC4.2 64.18,53.22 64.51,52.88 64.51,52.58 78.23,38.86 79.25,38.86 80.01,38.1 82.55,38.1 93.88,26.77 93.88,14.63 94.28,14.22 95.3,14.22 97.54,16.46 97.54,25.25 107.44,35.15 111.35,35.15 115.82,39.62 115.82,41.66 116.84,42.67 122.94,42.67 123.11,42.84 v123.11,43.2 | v130.78,42.77 135.89,42.77 v136.19,42.48
ENCODER_A  (via drill 0.35)
  Top 0.254: SW1.A 140.82,89.81 143.05,87.58 143.05,85.14 142.65,84.73 v142.65,22.03
  Bottom 0.254: v142.65,22.03 140.93,20.32 U$1.D2
ENCODER_B  (via drill 0.35)
  Top 0.254: v146.51,85.34 145.69,84.53 145.69,16.46 139.8,10.57 139.8,10.16 U$1.D6
  Bottom 0.254: v146.51,85.34 146.51,86.77 143.46,89.81 SW1.B
ENCODER_BUTTON  (via drill 0.35)
  Top 0.254: v131.47,84.53 131.47,86.77 v134.31,89.61
  Bottom 0.254: SW1.D 140.61,104.44 139.8,105.26 138.18,105.26 R28.1 137.97,105.26 135.13,102.41 135.13,90.42 v134.31,89.61 | v131.47,84.53 130.86,83.92 130.86,80.26 IC7.5
GATE_OUT  (via drill 0.35)
  Top 0.254: v147.32,76.2 149.38,76.2 153.24,80.06 v154.84,80.06 | U$1.D5 141.43,14.37 141.43,48.97 137.57,52.83 137.57,77.72 139.62,79.77 v140.94,79.77
  Bottom 0.254: v140.94,79.77 143.75,79.77 v147.32,76.2 | v154.84,80.06 154.84,81.69 IC5.3
GND  (via drill 0.35)
  Top 0.254: ANIMATION_AMMOUNT.P$3 138.79,59.13 138.79,73.97 SWING.P$3 | 128.33,39.31 JP1.2 | 125.79,39.31 JP1.1 | ANIMATION_IN.P1 153.42,12.6 153.42,14.22 RESET_OUT.P1 | v153.42,77.01 153.42,76 152.6,75.18 152.6,73.15 153.42,72.34 153.42,72.14 154.84,70.71 155.25,70.71 157.89,68.07 v157.89,64.01 | CLOCK_OUT.P1 153.21,55.68 150.57,53.03 150.57,45.52 153.21,42.88 153.21,42.06 CLOCK_IN.P1 153.21,41.86 150.57,39.22 150.57,31.5 153.21,28.85 153.21,28.04 RESET_IN.P1
  Bottom 0.254: 157.48,22.35 157.48,18.49 153.42,14.43 RESET_OUT.P1 | 157.48,22.35 157.48,23.16 R41.2 | 157.48,22.35 154.23,22.35 151.99,24.59 151.99,25.81 153.21,27.03 153.21,27.84 RESET_IN.P1 | R43.2 157.89,65.02 v157.89,64.01 157.89,60.35 153.42,55.88 CLOCK_OUT.P1 | v153.42,77.01 153.01,77.42 153.01,78.03 R51.2
  other vias: 127.64,60.96 158.12,58.42 147.96,70.48 147.32,52.07 95.94,19.48 98.98,19.56 68.58,29.08 60.83,7.92 142.9,4.72 132.97,10.54 127.15,6.93 121.64,25.68 91.62,45.77 83.77,47.52 85.12,61.59 96.42,66.55 96.29,84.86 144.45,67.23 143.48,88.39 47.78,19.46 151.49,57.33 160.5,58.45 160.48,44.17 121.84,97.84 127.86,97.84 101.24,98.86 94.13,90.93 84.56,88.54 87.27,99.42 81.48,101.24 93.29,96.44 73.15,99.24 65.68,101.14 51.66,98.53 37.52,98.73 31.34,98.91 26.21,98.81 16.97,99.36 11.58,105.41 25.55,71.78 40.77,71.45 48.29,72.01 66.93,73.03 82.19,72.92 66.65,52.12 67.08,44.6 67.34,38.84 66.55,35.92 80.9,39.24 53.72,37.52 53.19,42.8 38.81,41.53 39.95,46 26.92,43.71 11.96,40.72 2.82,9.78 3.2,15.27 10.44,15.98 25.25,13.87 25.58,19.25 10.08,21.54 34.32,12.67 67.01,14.15 66.52,19.02 82.52,19.23 82.45,10.49 141.12,57.3 138.23,84.86 105.51,30.99 108.48,27.76 109.88,22.68 105.99,12.45 115.44,29.26 101.73,51.44 127.05,82.17 119.46,75.09 121.41,74.85 114.17,41.35 103.17,68.33 87.25,43.59 75.46,49.15 56.57,75.79 48.31,76.28 62.38,76.3 76.17,76.38 20.27,76.35 1.7,70.15 2.69,56.82 34.24,48.46 54.05,6.27 68.48,6.63 91.39,12.32 143.51,18.92 156.31,19.08 155.6,44.58 155.37,59.87 158.29,72.57 132.46,82.83 136.53,77.83 107.16,61.75 98.2,44.68 96.42,73.94 119.3,45.54 44.07,11.86 43.99,14.88 49.2,28.91 48.36,54.41 131.6,104.83 82.02,95.33 68.58,94.11 55.68,95.58 40.61,94.21 26.34,93.78 10.41,99.16 11.53,65.35 26.34,66.04 40.28,66.22 56.79,67.16 67.39,66.98 78.49,67.94 114.05,75.06 127.36,76.71 141.1,77.72 135.53,63.17 114.25,61.62 121.62,20.09 67.18,23.39 54.74,30.33 39.73,51.46 11.71,51.33 75.46,44.65 107.82,42.7 107.42,32.26 111.2,24.36 123.16,34.01 113.36,34.34 120.29,31.04 115.57,37.31 118.41,28.6 110.92,56.77 112.12,63.17 113.89,67.94 115.01,65.91 113.72,82.88 117.37,99.24 148.74,79.3 139.04,88.57 76.23,71.09 55.09,57.99 2.82,33.81 86.94,10.49 43.21,18.95 77.9,47.07 130.68,54.97 52.86,50.6 54.43,47.6 53.98,53.29 60.76,49.17 19.56,20.42 158.19,91.92 137.01,15.72 56.74,87.4 56.62,81.89 131.78,77.5 68.07,53.09 10.16,3.81 85.09,33.02 80.64,43.18 134.25,18.86 124.18,44.35
  pour Top (isolate 0.203): 0,0 0,111.43 176.51,111.43 176.51,0
  pour Bottom (isolate 0.203, rank 2): 0,0 0,111.43 176.51,111.43 176.51,0
JACKSI/O  (via drill 0.35)
  Top 0.254: v139.73,78.42 139.73,77.89 v138.4,76.56 | v133.35,41.97 133.35,51.19 133.77,51.61 133.77,56.83 129.63,60.97 129.63,72.51 134.06,76.93 134.08,76.92 v136.85,76.92 | v130.45,41.86 124.69,41.86 123.09,40.26 123.09,38.09 v123.88,37.31 | v127.35,30.16 128.14,29.37 v129.51,29.37
  Bottom 0.254: IC7.3 133.24,81.54 133.72,82.03 138.37,82.03 139.73,80.67 v139.73,78.42 | v138.4,76.56 138.04,76.92 v136.85,76.92 | v133.35,41.97 130.56,41.97 v130.45,41.86 | v123.88,37.31 124.33,36.85 124.33,31.93 124.85,31.41 125.56,31.41 126.81,30.16 v127.35,30.16 | v129.51,29.37 129.51,18.62 128.73,17.83 128.78,17.78 U$1.A2
LED_DATA  (via drill 0.35)
  Top 0.254: v143.46,23.98 143.46,85.75 146.91,89.2 146.91,104.85 141.63,110.13 4.06,110.13 1.83,107.9 1.83,106.88 LED1.1
  Bottom 0.254: v143.46,23.98 143.46,21.48 U$1.D3
MATRIX_LED_DATA_OUT
  Top 0.254: LED57.3 1.63,8.53 1.63,7.92 1.42,7.72 1.42,4.67 4.47,1.63 106.68,1.63 113.59,8.53 LED72.1
N$1
  Top 0.254: LED9.1 5.49,94.08 5.69,94.28 8.94,94.28 10.36,92.86 15.65,92.86 LED10.3
N$2
  Top 0.254: LED11.3 29.46,92.86 24.38,92.86 22.96,94.28 19.71,94.28 19.51,94.08 LED10.1
N$3
  Top 0.254: LED12.3 43.48,92.86 38.41,92.86 36.98,94.28 33.73,94.28 33.53,94.08 LED11.1
N$4
  Top 0.254: LED13.3 57.51,92.86 52.43,92.86 51,94.28 47.75,94.28 47.55,94.08 LED12.1
N$5
  Top 0.254: LED14.3 71.53,92.86 66.45,92.86 65.02,94.28 61.57,94.28 61.37,94.08 LED13.1
N$6
  Top 0.254: LED15.3 85.55,92.86 80.47,92.86 79.05,94.28 75.59,94.28 75.39,94.08 LED14.1
N$7
  Top 0.254: LED16.3 99.57,92.86 94.49,92.86 93.07,94.28 89.61,94.28 89.41,94.08 LED15.1
N$8
  Top 0.254: LED26.3 15.65,64.82 14.83,64.82 13.21,66.45 5.89,66.45 5.49,66.04 LED25.1
N$9
  Top 0.254: LED27.3 29.46,64.82 24.38,64.82 22.76,66.45 19.91,66.45 19.51,66.04 LED26.1
N$10
  Top 0.254: LED28.3 43.48,64.82 38.41,64.82 36.78,66.45 33.93,66.45 33.53,66.04 LED27.1
N$11
  Top 0.254: LED29.3 57.51,64.82 52.43,64.82 50.8,66.45 47.95,66.45 47.55,66.04 LED28.1
N$12
  Top 0.254: LED30.3 71.53,64.82 66.45,64.82 64.82,66.45 61.77,66.45 61.37,66.04 LED29.1
N$13
  Top 0.254: LED31.3 85.55,64.82 84.94,64.82 83.31,66.45 75.79,66.45 75.39,66.04 LED30.1
N$14
  Top 0.254: LED32.3 99.57,64.82 94.49,64.82 92.86,66.45 89.81,66.45 89.41,66.04 LED31.1
N$15
  Top 0.254: LED41.1 5.49,38 8.33,38 8.74,38.41 17.07,38.41 17.68,37.8 19.3,37.8 LED42.3
N$16
  Top 0.254: 19.82,34.43 19.71,34.54 | 19.71,34.54 17.68,36.58 15.85,36.58 LED42.1 | 19.98,34.43 27.34,34.43 27.32,34.43 29.46,36.58 LED43.3 | 19.98,34.43 19.84,34.43 | 19.98,34.43 19.82,34.43 | 19.82,34.43 19.71,34.54
N$17
  Top 0.254: LED44.3 43.48,36.78 42.88,36.78 41.25,38.41 33.93,38.41 33.53,38 LED43.1
N$18
  Top 0.254: LED45.3 57.51,36.78 56.9,36.78 55.27,38.41 47.95,38.41 47.55,38 LED44.1
N$19
  Top 0.254: LED46.3 71.53,36.58 71.12,36.58 69.49,34.95 64.01,34.95 61.16,37.8 LED45.1
N$20
  Top 0.254: LED47.3 85.55,36.58 80.06,36.58 78.44,34.95 78.03,34.95 75.18,37.8 LED46.1
N$21
  Top 0.254: LED48.3 99.57,36.58 94.08,36.58 92.46,34.95 92.05,34.95 89.2,37.8 LED47.1
N$22
  Top 0.254: LED2.1 15.65,106.88 10.36,106.88 8.94,108.31 5.69,108.31 5.49,108.1 LED1.3
N$23
  Top 0.254: LED3.1 29.46,106.88 24.38,106.88 22.96,108.31 19.71,108.31 19.51,108.1 LED2.3
N$24
  Top 0.254: LED4.1 43.48,106.88 38.41,106.88 36.98,108.31 33.73,108.31 33.53,108.1 LED3.3
N$25
  Top 0.254: LED5.1 57.51,106.88 52.43,106.88 51,108.31 47.75,108.31 47.55,108.1 LED4.3
N$26
  Top 0.254: LED6.1 71.53,106.88 66.45,106.88 65.02,108.31 61.57,108.31 61.37,108.1 LED5.3
N$27
  Top 0.254: LED7.1 85.55,106.88 80.47,106.88 79.05,108.31 75.59,108.31 75.39,108.1 LED6.3
N$28
  Top 0.254: LED8.1 99.57,106.88 94.28,106.88 92.86,108.31 89.61,108.31 89.41,108.1 LED7.3
N$29
  Top 0.254: LED58.3 15.65,8.53 15.04,8.53 13.41,6.91 8.13,6.91 5.28,9.75 LED57.1
N$30
  Top 0.254: LED32.1 103.43,66.04 103.43,66.45 104.44,67.46 104.44,77.01 103.23,78.23 103.23,79.86 LED24.3
N$31
  Top 0.254: LED48.1 103.43,38 103.43,38.41 104.24,39.22 104.24,51 103.43,51.82 LED40.3
N$32
  Top 0.254: LED64.1 103.43,9.96 103.43,10.77 104.65,11.99 104.65,21.74 103.43,22.96 103.43,23.77 LED56.3
N$33
  Top 0.254: LED49.1 1.63,22.76 1.63,31.29 1.42,31.5 1.42,36.37 1.63,36.58 LED41.3
N$34
  Top 0.254: LED33.1 1.63,50.8 1.63,62.99 1.42,63.2 1.42,64.41 1.63,64.62 LED25.3
N$35
  Top 0.254: LED17.1 1.63,78.84 1.63,89.81 1.42,90.02 1.42,92.46 1.63,92.66 LED9.3
N$36
  Top 0.254: LED59.3 29.46,8.53 23.98,8.53 22.35,6.91 22.15,6.91 19.3,9.75 LED58.1
N$37
  Top 0.254: LED60.3 43.48,8.53 38,8.53 36.37,6.91 36.17,6.91 33.33,9.75 LED59.1
N$38
  Top 0.254: LED61.3 57.51,8.53 52.02,8.53 50.39,6.91 50.19,6.91 47.35,9.75 LED60.1
N$39
  Top 0.254: LED62.3 71.53,8.53 66.04,8.53 64.41,6.91 64.01,6.91 61.16,9.75 LED61.1
N$40
  Top 0.254: LED63.3 85.55,8.53 80.06,8.53 78.44,6.91 78.03,6.91 75.18,9.75 LED62.1
N$41
  Top 0.254: LED64.3 99.57,8.53 94.08,8.53 92.46,6.91 92.05,6.91 89.2,9.75 LED63.1
N$42
  Bottom 0.254: 40.77,12.6 40.77,13.74 40.88,13.85 40.87,13.85 40.86,13.84
N$43
  Bottom 0.254: TXLED-BLUE.A 46.74,60.76 44.91,60.76 R2.2
N$44
  Bottom 0.254: RXLED-GREEN.A 46.74,57.71 44.91,57.71 R3.2
N$45
  Top 0.254: LED18.1 15.65,78.84 10.36,78.84 8.74,80.47 5.89,80.47 5.49,80.06 LED17.3
N$46
  Top 0.254: LED19.1 29.46,78.84 24.38,78.84 22.76,80.47 19.91,80.47 19.51,80.06 LED18.3
N$47
  Top 0.254: LED20.1 43.48,78.84 38.41,78.84 36.78,80.47 33.93,80.47 33.53,80.06 LED19.3
N$48
  Top 0.254: LED21.1 57.51,78.84 52.43,78.84 50.8,80.47 47.95,80.47 47.55,80.06 LED20.3
N$49
  Top 0.254: LED22.1 71.53,78.84 66.45,78.84 64.82,80.47 61.77,80.47 61.37,80.06 LED21.3
N$50
  Top 0.254: LED23.1 85.55,78.84 80.47,78.84 78.84,80.47 75.79,80.47 75.39,80.06 LED22.3
N$51
  Top 0.254: LED24.1 99.57,78.84 94.49,78.84 92.86,80.47 89.81,80.47 89.41,80.06 LED23.3
N$52
  Bottom 0.254: U$2.2 54.05,90.22 54.05,93.88 53.85,94.08 X1.VUSB
N$53
  Bottom 0.254: TXLED-BLUE.C 48.36,60.76 48.36,59.13 49.15,58.34 49.15,56.92 55.47,50.6 56.08,50.6 IC4.23
N$54
  Bottom 0.254: RXLED-GREEN.C 48.36,57.71 48.36,57.1 55.47,49.99 56.08,49.99 IC4.22
N$55
  Bottom 0.254: R5.1 174.35,53.85 170.89,57.3 168.66,57.3 164.59,53.24 D1.C
N$56  (via drill 0.35)
  Top 0.254: v173.33,39.62 172.92,39.62 170.89,37.59 v165.81,37.59
  Bottom 0.254: v173.33,39.62 174.35,38.61 R6.1 | v165.81,37.59 164.59,38.81 D2.C
N$57  (via drill 0.35)
  Top 0.254: v51.61,61.98 53.01,61.98 58.12,56.87 v58.12,55.47
  Bottom 0.254: v58.12,55.47 58.12,46.53 57.1,45.52 56.29,45.52 IC4.15 | v51.61,61.98 51.61,91.44 50.19,92.86 50.19,94.08 X1.D+
N$58
  Bottom 0.254: IC4.16 56.29,46.13 57.1,46.13 57.71,46.74 57.71,54.25 52.43,59.54 52.43,91.85 51.41,92.86 51.41,94.08 X1.D-
N$59
  Bottom 0.254: C6.2 54.46,45.72 55.47,46.74 56.08,46.74 IC4.17
N$60
  Bottom 0.254: R15.1 172.72,36.58 172.72,38.41 R6.2 172.72,38.61 171.09,38.61 170.49,39.22 OUT6.P3
N$61
  Bottom 0.254: 172.72,53.24 172.72,53.65 R5.2 | 172.72,53.24 172.72,52.02 R16.1 | 172.72,53.24 170.49,53.24 OUT5.P3
N$62
  Bottom 0.254: R7.1 174.35,81.28 174.35,81.89 170.89,85.34 169.27,85.34 164.59,80.67 D3.C
N$63
  Bottom 0.254: R8.1 174.35,67.26 174.35,67.87 170.89,71.32 169.67,71.32 164.59,66.24 D4.C
N$64
  Bottom 0.254: R11.1 174.35,24.99 172.92,26.42 166.83,26.42 164.59,24.18 D7.C
N$65  (via drill 0.35)
  Top 0.254: v173.53,2.85 170.89,2.85 169.27,4.47 169.06,4.47 v164.79,8.74
  Bottom 0.254: v173.53,2.85 173.53,2.64 174.35,1.83 R12.1 | v164.79,8.74 164.79,9.75 164.59,9.96 D8.C
N$66
  Bottom 0.254: 172.72,1.83 170.49,1.83 OUT8.P3 | 172.72,1.83 R12.2 172.72,1.83 | 172.72,1.83 172.72,4.27 R13.1
N$67
  Bottom 0.254: R14.1 172.72,22.55 172.72,24.79 R11.2 172.72,24.99 170.49,24.99 OUT7.P3
N$68
  Top 0.254: LED34.1 15.65,50.8 15.04,50.8 13.41,52.43 5.89,52.43 5.49,52.02 LED33.3
N$69
  Top 0.254: LED35.1 29.46,50.8 24.38,50.8 22.76,52.43 19.91,52.43 19.51,52.02 LED34.3
N$70
  Top 0.254: LED36.1 43.48,50.8 42.88,50.8 41.25,52.43 33.93,52.43 33.53,52.02 LED35.3
N$71
  Top 0.254: LED37.1 54.04,54.3 49.84,54.3 47.55,52.02 LED36.3
N$72
  Top 0.254: LED38.1 71.08,51.18 68.83,51.18 66.52,53.49 62.03,53.49 61.37,52.83 61.37,52.02 LED37.3
N$73
  Top 0.254: LED39.1 85.55,50.8 81.08,50.8 79.05,52.83 76.2,52.83 75.39,52.02 LED38.3
N$74
  Top 0.254: LED40.1 99.57,50.8 96.11,50.8 94.08,52.83 90.22,52.83 89.41,52.02 LED39.3
N$75
  Bottom 0.254: R17.1 172.72,65.02 172.72,67.06 R8.2 172.72,67.26 170.49,67.26 OUT4.P3
N$76
  Bottom 0.254: R18.1 172.72,79.05 172.72,81.08 R7.2 172.72,81.28 170.49,81.28 OUT3.P3
N$77
  Bottom 0.254: 166.27,109.32 166.24,109.3 165.58,109.3 D5.C 165.58,109.3 R9.1
N$78
  Bottom 0.254: R10.1 174.35,95.1 174.35,95.91 170.89,99.36 169.67,99.36 164.59,94.28 D6.C
N$79
  Bottom 0.254: R19.1 172.72,93.27 172.72,94.89 R10.2 172.72,95.1 170.69,95.1 170.49,95.3 OUT2.P3
N$80
  Bottom 0.254: R9.2 168.06,109.32 OUT1.P3 172.32,109.32 172.72,108.92 172.77,108.97 R20.1
N$81
  Bottom 0.254: D5.A 160.32,108.1 160.32,104.44 OUT1_LED.A 160.52,98.18 158.72,96.39 158.72,94.26 153.44,88.98 IC5.13
N$82
  Bottom 0.254: D6.A 160.32,94.08 160.32,90.42 OUT2_LED.A 160.32,90.22 156.46,90.22 154.84,88.59 154.84,87.99 IC5.14
N$83
  Bottom 0.254: OUT3_LED.A 160.32,76.4 160.32,80.47 D3.A 160.32,80.67 156.06,84.94 156.06,87.78 IC5.15
N$84
  Bottom 0.254: 160.32,66.04 160.32,62.59 OUT4_LED.A | 160.32,66.04 D4.A 160.32,66.04 | 160.32,66.04 157.28,66.04 157.07,66.24 157.07,67.46 156.87,67.67 156.26,67.67 153.42,70.51 153.42,72.75 154.23,73.56 154.23,75.18 151.99,77.42 151.99,78.84 152.81,79.65 152.81,82.91 152.2,83.52 152.2,87.78 IC5.12
N$85
  Bottom 0.254: OUT5_LED.A 160.32,48.56 160.32,53.03 D1.A 160.53,53.03 162.36,54.86 162.36,56.69 161.95,57.1 161.95,70.92 157.28,75.59 157.28,81.69 IC5.1
N$86  (via drill 0.35)
  Top 0.254: v153.42,74.98 159.51,68.89 159.51,35.36 160.32,34.54 OUT6_LED.A
  Bottom 0.254: D2.A 160.32,34.54 OUT6_LED.A | v153.42,74.98 151.59,76.81 151.59,79.05 151.99,79.45 151.99,81.69 IC5.5
N$87  (via drill 0.35)
  Top 0.254: v156.06,79.25 156.06,72.95 161.54,67.46 161.54,21.54 160.53,20.52 OUT7_LED.A
  Bottom 0.254: D7.A 160.32,23.98 160.32,20.52 OUT7_LED.A | v156.06,79.25 156.06,81.69 IC5.2
N$88  (via drill 0.35)
  Top 0.254: v155.65,71.32 155.65,70.92 159.11,67.46 159.11,7.72 160.32,6.5 OUT8_LED.A
  Bottom 0.254: D8.A 160.32,9.96 160.32,6.5 OUT8_LED.A | v155.65,71.32 155.65,78.64 155.25,79.05 154.84,79.05 153.62,80.26 153.62,81.69 IC5.4
N$89
  Top 0.254: LED66.1 113.79,92.86 113.79,105.46 116.03,107.7 117.04,107.7 117.25,107.9 LED65.3
N$90
  Top 0.254: LED65.1 113.79,106.88 114.61,106.88 115.82,108.1 116.43,108.1 117.25,108.92 120.29,108.92 129.03,100.18 129.03,82.7 124.16,77.83 124.16,46.94 119.08,41.86 119.08,39.62 117.45,38 LED70.3
N$91
  Top 0.254: LED50.1 15.65,22.76 10.57,22.76 8.94,24.38 5.89,24.38 5.49,23.98 LED49.3
N$92
  Top 0.254: LED51.1 29.46,22.76 24.59,22.76 22.96,24.38 19.91,24.38 19.51,23.98 LED50.3
N$93
  Top 0.254: LED52.1 43.48,22.76 38.41,22.76 36.78,24.38 33.93,24.38 33.53,23.98 LED51.3
N$94
  Top 0.254: LED53.1 57.51,22.76 52.43,22.76 50.8,24.38 47.95,24.38 47.55,23.98 LED52.3
N$95
  Top 0.254: LED54.1 71.53,22.76 70.92,22.76 69.29,24.38 61.77,24.38 61.37,23.98 LED53.3
N$96
  Top 0.254: LED55.1 85.55,22.76 80.47,22.76 78.84,24.38 75.79,24.38 75.39,23.98 LED54.3
N$97
  Top 0.254: LED56.1 99.57,22.76 97.94,24.38 89.81,24.38 89.41,23.98 LED55.3
N$98
  Top 0.254: LED66.3 117.25,93.88 116.23,93.88 112.32,89.97 112.32,80.03 LED67.1
N$99
  Top 0.254: LED68.1 113.59,64.82 112.78,65.63 112.78,76.53 115.29,79.05 116.48,79.05 LED67.3
N$100
  Top 0.254: LED69.1 113.59,50.8 113.59,52.43 110.13,55.88 110.13,59.74 116.23,65.84 117.25,65.84 LED68.3
N$101
  Top 0.254: LED71.1 113.59,22.55 111.76,22.55 106.88,17.68 106.48,17.68 105.05,19.1 105.05,21.95 104.44,22.55 104.44,32.92 109.12,37.59 109.12,44.7 116.23,51.82 117.25,51.82 LED69.3
N$102
  Top 0.254: LED72.3 117.45,9.96 117.86,10.36 117.86,21.34 112.12,27.08 112.12,35.16 LED70.1
N$104
  Bottom 0.254: R27.1 163.37,100.58 163.37,104.04 163.17,104.24 OUT1_LED.K
N$105
  Bottom 0.254: R26.1 163.37,86.36 163.37,90.02 163.17,90.22 OUT2_LED.K
N$107
  Bottom 0.254: R25.1 163.37,72.34 163.37,76 163.17,76.2 OUT3_LED.K
N$108
  Bottom 0.254: R24.1 163.37,59.33 163.37,62.18 163.17,62.38 OUT4_LED.K
N$109
  Bottom 0.254: R23.1 163.37,45.11 163.37,48.16 163.17,48.36 OUT5_LED.K
N$110
  Bottom 0.254: R22.1 163.37,31.09 163.37,34.14 163.17,34.34 OUT6_LED.K
N$111
  Bottom 0.254: R21.1 163.37,16.87 163.37,20.12 163.17,20.32 OUT7_LED.K
N$112
  Bottom 0.254: R4.1 163.37,2.64 163.37,6.1 163.17,6.3 OUT8_LED.K
N$113  (via drill 0.35)
  Top 0.254: U$3.10 128.22,56.08 125.78,56.08 U$3.9 | v90.17,26.67 91.44,27.94 91.44,31.75 v96.52,31.75 | v82.55,43.18 v85.09,45.72 | v93.98,44.45 v96.52,44.45 | v97.16,39.37 95.25,37.47 v94.61,37.47 | v45.09,71.12 v56.52,71.12 | v58.42,71.12 69.85,71.12 v70.48,71.75
  Bottom 0.254: U$3.9 125.58,55.88 124.36,54.66 124.36,52.83 115.42,43.89 115.42,39.83 111.15,35.56 106.2,35.56 102.46,31.83 100.43,33.86 97.79,33.86 | 97.79,33.86 U$4.2 97.51,32.74 v96.52,31.75 | v90.17,26.67 84.45,26.67 84.45,26.57 IC11.1 | IC8.1 71.5,71.75 | 71.5,71.75 71.5,55.88 | 71.5,55.88 71.5,54.23 78.01,47.72 78.17,47.72 78.56,47.34 78.56,47.17 v82.55,43.18 | v85.09,45.72 86.36,44.45 v93.98,44.45 | v96.52,44.45 96.52,40.01 v97.16,39.37 | v94.61,37.47 97.79,34.29 97.79,33.86 | IC10.1 76.11,55.88 71.5,55.88 | IC9.1 43.53,72.67 v45.09,71.12 | v56.52,71.12 v58.42,71.12 | v70.48,71.75 71.5,71.75
N$114
  Top 0.254: LED16.1 103.43,94.08 103.43,94.49 104.24,95.3 104.24,104.44 102.41,106.27 102.41,107.09 103.23,107.9 LED8.3
N$115
  Bottom 0.254: R35.1 158.29,53.03 159.11,53.85 159.11,54.05 160.93,55.88 D16.A
N$116
  Bottom 0.254: R33.1 157.89,39.01 157.89,39.62 160.12,41.86 D14.A
N$117
  Bottom 0.254: R30.1 148.74,1.83 148.74,2.85 147.52,4.06 D11.A
N$118
  Bottom 0.254: U$4.1 94.67,28.85 D9.A
N$119
  Bottom 0.254: D9.C 94.82,25.2 IC3.1
N$121
  Bottom 0.254: R30.2 150.77,1.83 153.21,1.83 ANIMATION_IN.P3
N$122
  Bottom 0.254: R32.1 157.68,24.99 160.53,27.84 D13.C
N$123  (via drill 0.35)
  other vias: 154.33,23.67
N$124
  Bottom 0.254: R33.2 155.85,39.01 153.62,39.01 153.42,39.22 RESET_IN.P3
N$125
  Bottom 0.254: R41.1 155.85,23.37 155.85,24.79 R32.2 155.65,24.99 153.42,24.99 RESET_OUT.P3
N$126
  Bottom 0.254: R34.1 158.09,66.85 158.09,67.26 160.53,69.7 D15.C
N$128
  Bottom 0.254: R35.2 156.26,53.03 153.62,53.03 153.42,53.24 CLOCK_IN.P3
N$129